# Altium schematic sheet Sheet.SchDoc
size A2; SheetNumber: 1; SheetTotal: 1
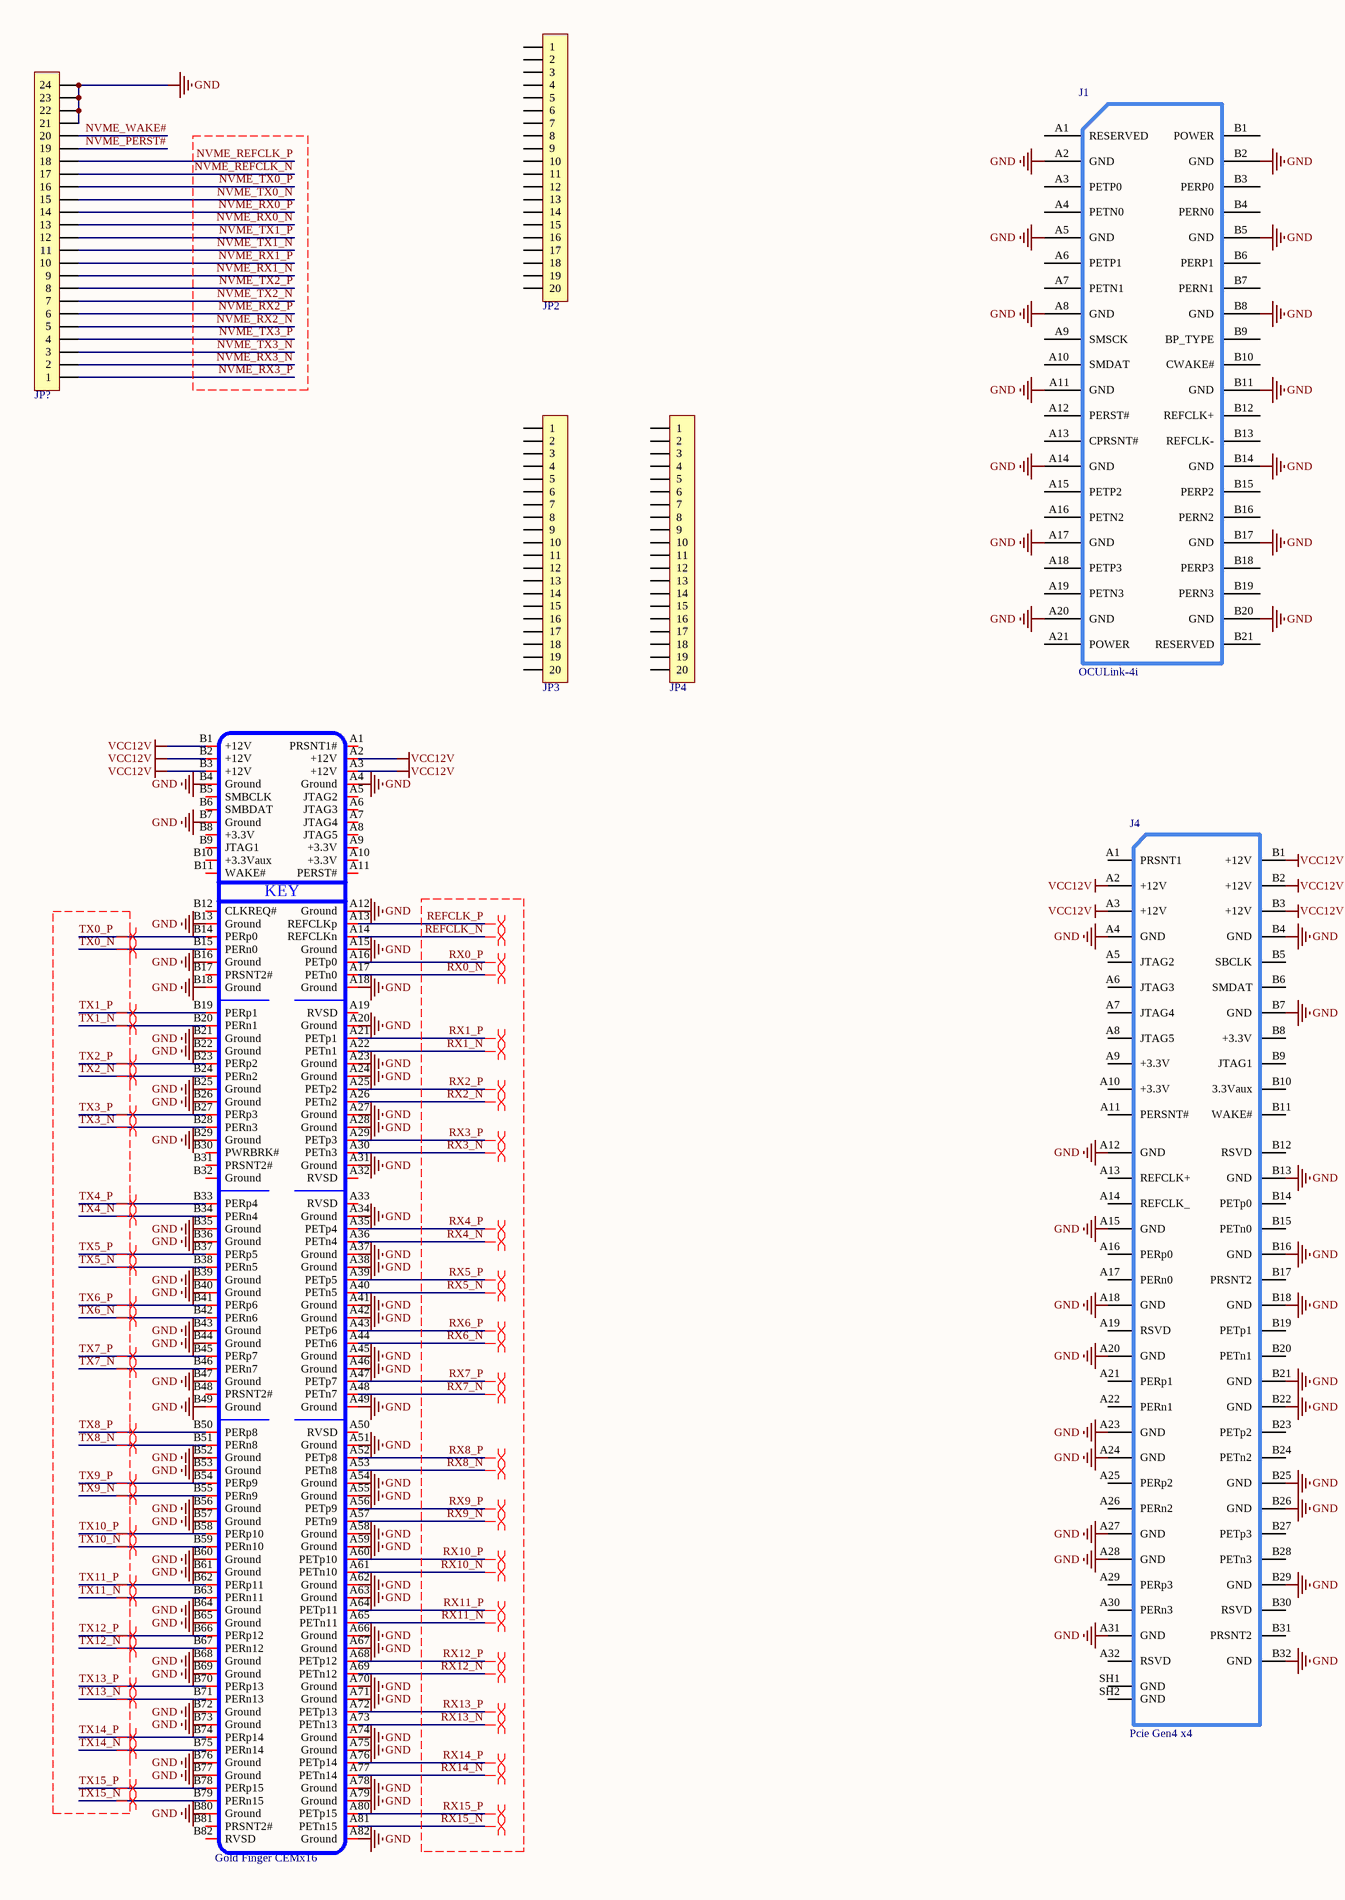
[diagram p0: Sheet.SchDoc, left]
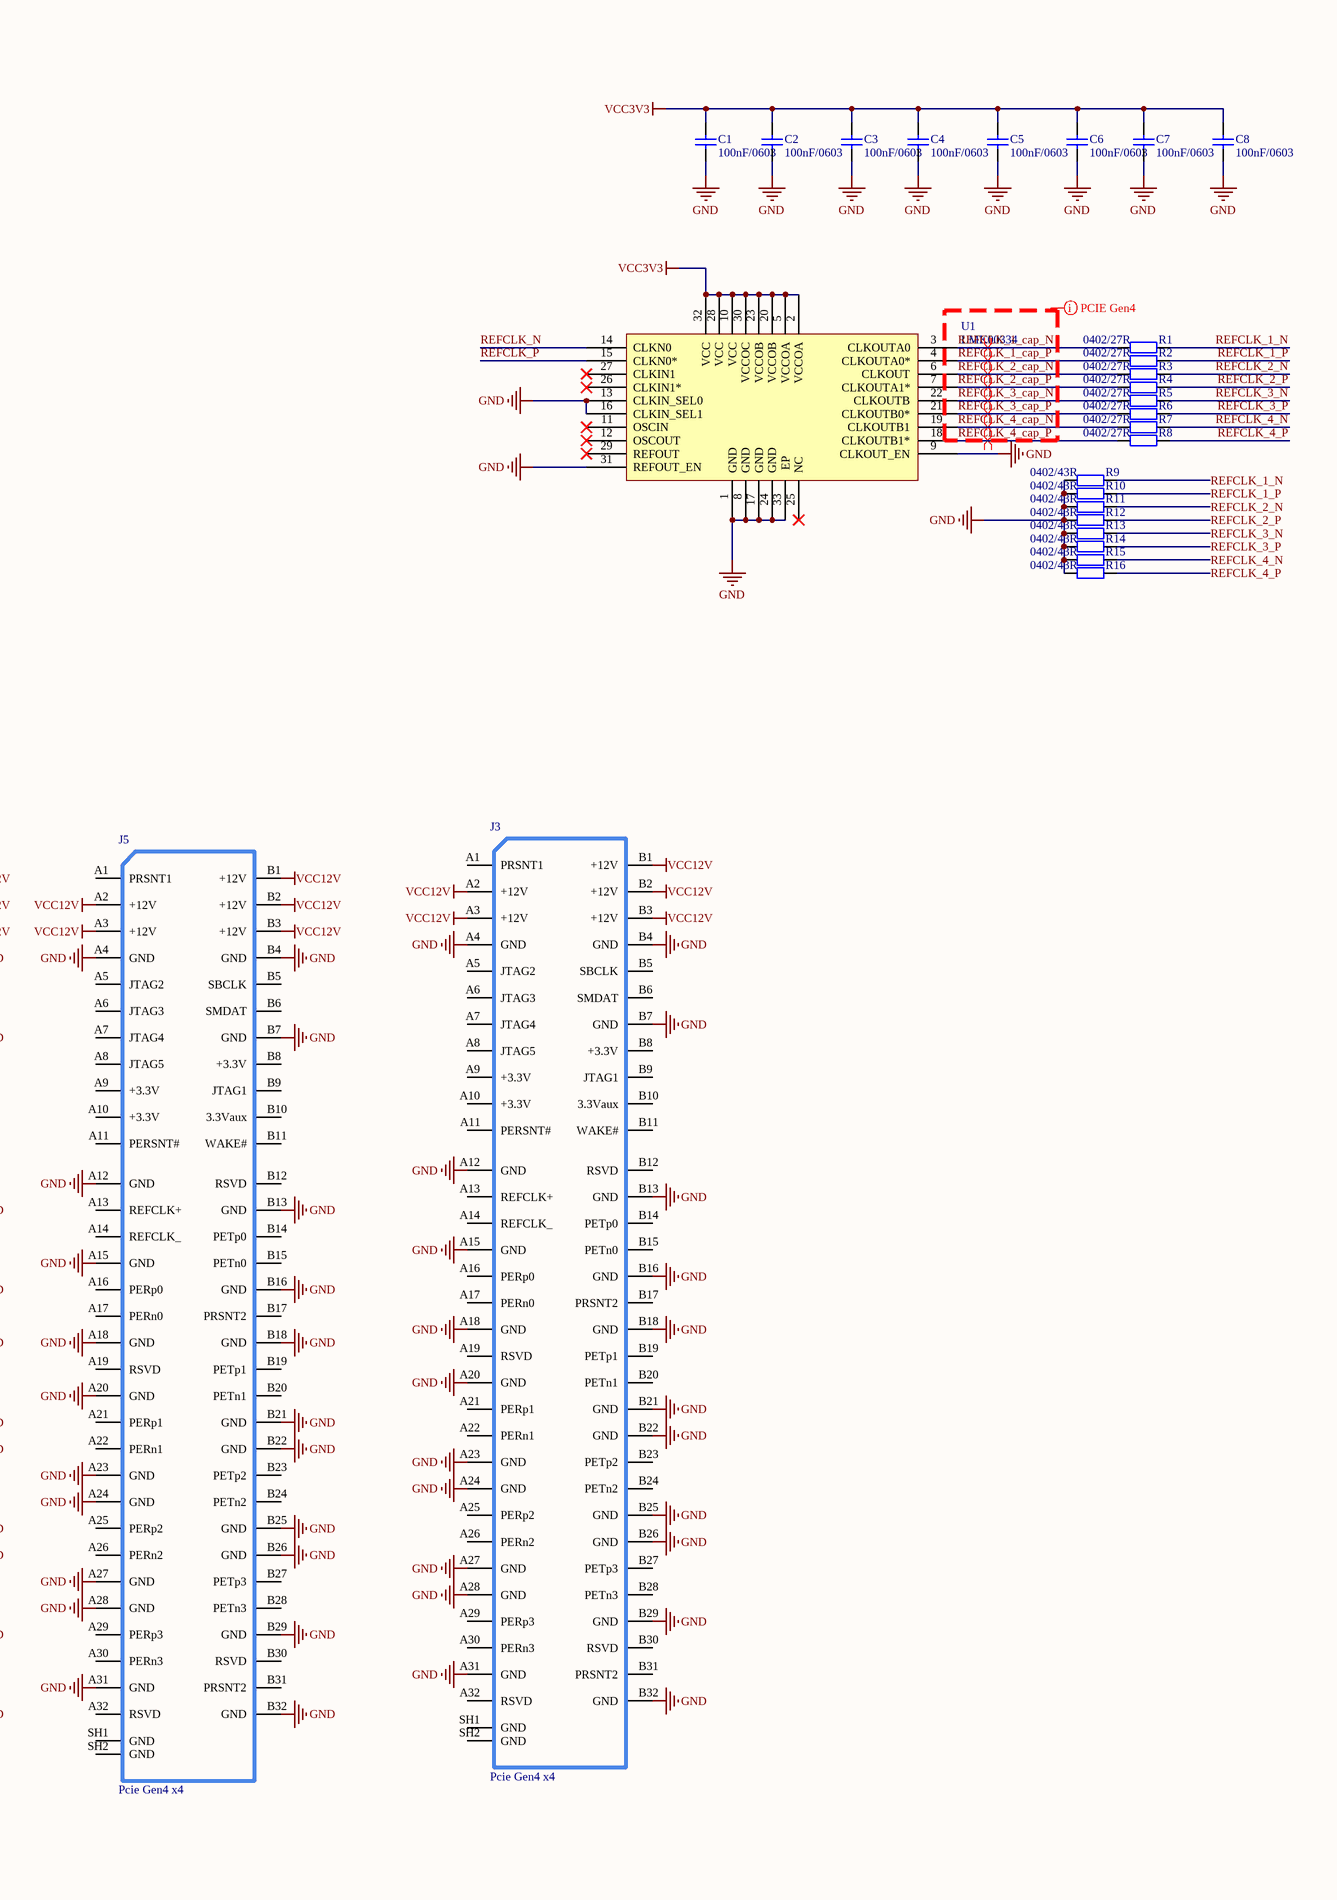
[diagram p1: Sheet.SchDoc, right]

## Parts
C1  100nF/0603  [c0603_l]
C2  100nF/0603  [c0603_l]
C3  100nF/0603  [c0603_l]
C4  100nF/0603  [c0603_l]
C5  100nF/0603  [c0603_l]
C6  100nF/0603  [c0603_l]
C7  100nF/0603  [c0603_l]
C8  100nF/0603  [c0603_l]
J1  OCULink-4i  [SFF8611_卧式]
J2  Device: Gold Finger CEMx16  [CON_PCI-E_164_M]  (hidden comment: Pcie Gen4 x16)
J3  Pcie Gen4 x4  [PCIe Gen4 X4 贴片]
J4  Pcie Gen4 x4  [PCIe Gen4 X4 贴片]
J5  Pcie Gen4 x4  [PCIe Gen4 X4 贴片]
JP2  FPC1.0-20P  [CONN-SMD_20P-P0.50_I-PEX_20455-020E-02]  (value not drawn)
JP3  FPC1.0-20P  [CONN-SMD_20P-P0.50_I-PEX_20455-020E-02]  (value not drawn)
JP4  FPC1.0-20P  [CONN-SMD_20P-P0.50_I-PEX_20455-020E-02]  (value not drawn)
JP?  FPC1.0-24P  [CONN-SMD_20P-P0.50_I-PEX_20455-020E-02]  (value not drawn)
R1  0402/27R  [r0402_l]
R2  0402/27R  [r0402_l]
R3  0402/27R  [r0402_l]
R4  0402/27R  [r0402_l]
R5  0402/27R  [r0402_l]
R6  0402/27R  [r0402_l]
R7  0402/27R  [r0402_l]
R8  0402/27R  [r0402_l]
R9  0402/43R  [r0402_l]
R10  0402/43R  [r0402_l]
R11  0402/43R  [r0402_l]
R12  0402/43R  [r0402_l]
R13  0402/43R  [r0402_l]
R14  0402/43R  [r0402_l]
R15  0402/43R  [r0402_l]
R16  0402/43R  [r0402_l]
U1  LMK00334  [QFN32 5x5_N]

## Nets
GND: C1.1 C2.1 C3.1 C4.1 C5.1 C6.1 C7.1 C8.1 J1.A2(GND) J1.A5(GND) J1.A8(GND) J1.A11(GND) J1.A14(GND) J1.A17(GND) J1.A20(GND) J1.B2(GND) J1.B5(GND) J1.B8(GND) J1.B11(GND) J1.B14(GND) J1.B17(GND) J1.B20(GND) J2.A4(Ground) J2.A12(Ground) J2.A15(Ground) J2.A18(Ground) J2.A20(Ground) J2.A23(Ground) J2.A24(Ground) J2.A27(Ground) J2.A28(Ground) J2.A31(Ground) J2.A34(Ground) J2.A37(Ground) J2.A38(Ground) J2.A41(Ground) J2.A42(Ground) J2.A45(Ground) J2.A46(Ground) J2.A49(Ground) J2.A51(Ground) J2.A54(Ground) J2.A55(Ground) J2.A58(Ground) J2.A59(Ground) J2.A62(Ground) J2.A63(Ground) J2.A66(Ground) J2.A67(Ground) J2.A70(Ground) J2.A71(Ground) J2.A74(Ground) J2.A75(Ground) J2.A78(Ground) J2.A79(Ground) J2.A82(Ground) J2.B4(Ground) J2.B7(Ground) J2.B13(Ground) J2.B16(Ground) J2.B18(Ground) J2.B21(Ground) J2.B22(Ground) J2.B25(Ground) J2.B26(Ground) J2.B29(Ground) J2.B35(Ground) J2.B36(Ground) J2.B39(Ground) J2.B40(Ground) J2.B43(Ground) J2.B44(Ground) J2.B47(Ground) J2.B49(Ground) J2.B52(Ground) J2.B53(Ground) J2.B56(Ground) J2.B57(Ground) J2.B60(Ground) J2.B61(Ground) J2.B64(Ground) J2.B65(Ground) J2.B68(Ground) J2.B69(Ground) J2.B72(Ground) J2.B73(Ground) J2.B76(Ground) J2.B77(Ground) J2.B80(Ground) J3.A4(GND) J3.A12(GND) J3.A15(GND) J3.A18(GND) J3.A20(GND) J3.A23(GND) J3.A24(GND) J3.A27(GND) J3.A28(GND) J3.A31(GND) J3.B4(GND) J3.B7(GND) J3.B13(GND) J3.B16(GND) J3.B18(GND) J3.B21(GND) J3.B22(GND) J3.B25(GND) J3.B26(GND) J3.B29(GND) J3.B32(GND) J4.A4(GND) J4.A12(GND) J4.A15(GND) J4.A18(GND) J4.A20(GND) J4.A23(GND) J4.A24(GND) J4.A27(GND) J4.A28(GND) J4.A31(GND) J4.B4(GND) J4.B7(GND) J4.B13(GND) J4.B16(GND) J4.B18(GND) J4.B21(GND) J4.B22(GND) J4.B25(GND) J4.B26(GND) J4.B29(GND) J4.B32(GND) J5.A4(GND) J5.A12(GND) J5.A15(GND) J5.A18(GND) J5.A20(GND) J5.A23(GND) J5.A24(GND) J5.A27(GND) J5.A28(GND) J5.A31(GND) J5.B4(GND) J5.B7(GND) J5.B13(GND) J5.B16(GND) J5.B18(GND) J5.B21(GND) J5.B22(GND) J5.B25(GND) J5.B26(GND) J5.B29(GND) J5.B32(GND) JP?.21 JP?.22 JP?.23 JP?.24 R9.2 R10.2 R11.2 R12.2 R13.2 R14.2 R15.2 R16.2 U1.1(GND) U1.8(GND) U1.9(CLKOUT_EN) U1.13(CLKIN_SEL0) U1.16(CLKIN_SEL1) U1.17(GND) U1.24(GND) U1.31(REFOUT_EN) U1.33(EP)
VCC3V3: C1.2 C2.2 C3.2 C4.2 C5.2 C6.2 C7.2 C8.2 U1.2(VCCOA) U1.5(VCCOA) U1.10(VCC) U1.20(VCCOB) U1.23(VCCOB) U1.28(VCC) U1.30(VCCOC) U1.32(VCC)
VCC12V: J2.A2(+12V) J2.A3(+12V) J2.B1(+12V) J2.B2(+12V) J2.B3(+12V) J3.A2(+12V) J3.A3(+12V) J3.B1(+12V) J3.B2(+12V) J3.B3(+12V) J4.A2(+12V) J4.A3(+12V) J4.B1(+12V) J4.B2(+12V) J4.B3(+12V) J5.A2(+12V) J5.A3(+12V) J5.B1(+12V) J5.B2(+12V) J5.B3(+12V)
NVME_PERST#: JP?.19
NVME_REFCLK_N: JP?.17
NVME_REFCLK_P: JP?.18
NVME_RX0_N: JP?.13
NVME_RX0_P: JP?.14
NVME_RX1_N: JP?.9
NVME_RX1_P: JP?.10
NVME_RX2_N: JP?.5
NVME_RX2_P: JP?.6
NVME_RX3_N: JP?.2
NVME_RX3_P: JP?.1
NVME_TX0_N: JP?.15
NVME_TX0_P: JP?.16
NVME_TX1_N: JP?.11
NVME_TX1_P: JP?.12
NVME_TX2_N: JP?.7
NVME_TX2_P: JP?.8
NVME_TX3_N: JP?.3
NVME_TX3_P: JP?.4
NVME_WAKE#: JP?.20
REFCLK_1_cap_N: R1.2 U1.3(CLKOUTA0)
REFCLK_1_cap_P: R2.2 U1.4(CLKOUTA0*)
REFCLK_1_N: R1.1 R9.1
REFCLK_1_P: R2.1 R10.1
REFCLK_2_cap_N: R3.2 U1.6(CLKOUT)
REFCLK_2_cap_P: R4.2 U1.7(CLKOUTA1*)
REFCLK_2_N: R3.1 R11.1
REFCLK_2_P: R4.1 R12.1
REFCLK_3_cap_N: R5.2 U1.22(CLKOUTB)
REFCLK_3_cap_P: R6.2 U1.21(CLKOUTB0*)
REFCLK_3_N: R5.1 R13.1
REFCLK_3_P: R6.1 R14.1
REFCLK_4_cap_N: R7.2 U1.19(CLKOUTB1)
REFCLK_4_cap_P: R8.2 U1.18(CLKOUTB1*)
REFCLK_4_N: R7.1 R15.1
REFCLK_4_P: R8.1 R16.1
REFCLK_N: J2.A14(REFCLKn) U1.14(CLKN0)
REFCLK_P: J2.A13(REFCLKp) U1.15(CLKN0*)
RX0_N: J2.A17(PETn0)
RX0_P: J2.A16(PETp0)
RX1_N: J2.A22(PETn1)
RX1_P: J2.A21(PETp1)
RX2_N: J2.A26(PETn2)
RX2_P: J2.A25(PETp2)
RX3_N: J2.A30(PETn3)
RX3_P: J2.A29(PETp3)
RX4_N: J2.A36(PETn4)
RX4_P: J2.A35(PETp4)
RX5_N: J2.A40(PETn5)
RX5_P: J2.A39(PETp5)
RX6_N: J2.A44(PETn6)
RX6_P: J2.A43(PETp6)
RX7_N: J2.A48(PETn7)
RX7_P: J2.A47(PETp7)
RX8_N: J2.A53(PETn8)
RX8_P: J2.A52(PETp8)
RX9_N: J2.A57(PETn9)
RX9_P: J2.A56(PETp9)
RX10_N: J2.A61(PETn10)
RX10_P: J2.A60(PETp10)
RX11_N: J2.A65(PETn11)
RX11_P: J2.A64(PETp11)
RX12_N: J2.A69(PETn12)
RX12_P: J2.A68(PETp12)
RX13_N: J2.A73(PETn13)
RX13_P: J2.A72(PETp13)
RX14_N: J2.A77(PETn14)
RX14_P: J2.A76(PETp14)
RX15_N: J2.A81(PETn15)
RX15_P: J2.A80(PETp15)
TX0_N: J2.B15(PERn0)
TX0_P: J2.B14(PERp0)
TX1_N: J2.B20(PERn1)
TX1_P: J2.B19(PERp1)
TX2_N: J2.B24(PERn2)
TX2_P: J2.B23(PERp2)
TX3_N: J2.B28(PERn3)
TX3_P: J2.B27(PERp3)
TX4_N: J2.B34(PERn4)
TX4_P: J2.B33(PERp4)
TX5_N: J2.B38(PERn5)
TX5_P: J2.B37(PERp5)
TX6_N: J2.B42(PERn6)
TX6_P: J2.B41(PERp6)
TX7_N: J2.B46(PERn7)
TX7_P: J2.B45(PERp7)
TX8_N: J2.B51(PERn8)
TX8_P: J2.B50(PERp8)
TX9_N: J2.B55(PERn9)
TX9_P: J2.B54(PERp9)
TX10_N: J2.B59(PERn10)
TX10_P: J2.B58(PERp10)
TX11_N: J2.B63(PERn11)
TX11_P: J2.B62(PERp11)
TX12_N: J2.B67(PERn12)
TX12_P: J2.B66(PERp12)
TX13_N: J2.B71(PERn13)
TX13_P: J2.B70(PERp13)
TX14_N: J2.B75(PERn14)
TX14_P: J2.B74(PERp14)
TX15_N: J2.B79(PERn15)
TX15_P: J2.B78(PERp15)

Not connected (* = marked no-connect by the designer): J1 A1(RESERVED) A3(PETP0) A4(PETN0) A6(PETP1) A7(PETN1) A9(SMSCK) A10(SMDAT) A12(PERST#) A13(CPRSNT#) A15(PETP2) A16(PETN2) A18(PETP3) A19(PETN3) A21(POWER) B1(POWER) B3(PERP0) B4(PERN0) B6(PERP1) B7(PERN1) B9(BP_TYPE) B10(CWAKE#) B12(REFCLK+) B13(REFCLK-) B15(PERP2) B16(PERN2) B18(PERP3) B19(PERN3) B21(RESERVED); J2 A1(PRSNT1#) A5(JTAG2) A6(JTAG3) A7(JTAG4) A8(JTAG5) A9(+3.3V) A10(+3.3V) A11(PERST#) A19(RVSD) A32(RVSD) A33(RVSD) A50(RVSD) B5(SMBCLK) B6(SMBDAT) B8(+3.3V) B9(JTAG1) B10(+3.3Vaux) B11(WAKE#) B12(CLKREQ#) B17(PRSNT2#) B30(PWRBRK#) B31(PRSNT2#) B32(Ground) B48(PRSNT2#) B81(PRSNT2#) B82(RVSD); J3 A1(PRSNT1) A5(JTAG2) A6(JTAG3) A7(JTAG4) A8(JTAG5) A9(+3.3V) A10(+3.3V) A11(PERSNT#) A13(REFCLK+) A14(REFCLK_) A16(PERp0) A17(PERn0) A19(RSVD) A21(PERp1) A22(PERn1) A25(PERp2) A26(PERn2) A29(PERp3) A30(PERn3) A32(RSVD) B5(SBCLK) B6(SMDAT) B8(+3.3V) B9(JTAG1) B10(3.3Vaux) B11(WAKE#) B12(RSVD) B14(PETp0) B15(PETn0) B17(PRSNT2) B19(PETp1) B20(PETn1) B23(PETp2) B24(PETn2) B27(PETp3) B28(PETn3) B30(RSVD) B31(PRSNT2) SH1(GND) SH2(GND); J4 A1(PRSNT1) A5(JTAG2) A6(JTAG3) A7(JTAG4) A8(JTAG5) A9(+3.3V) A10(+3.3V) A11(PERSNT#) A13(REFCLK+) A14(REFCLK_) A16(PERp0) A17(PERn0) A19(RSVD) A21(PERp1) A22(PERn1) A25(PERp2) A26(PERn2) A29(PERp3) A30(PERn3) A32(RSVD) B5(SBCLK) B6(SMDAT) B8(+3.3V) B9(JTAG1) B10(3.3Vaux) B11(WAKE#) B12(RSVD) B14(PETp0) B15(PETn0) B17(PRSNT2) B19(PETp1) B20(PETn1) B23(PETp2) B24(PETn2) B27(PETp3) B28(PETn3) B30(RSVD) B31(PRSNT2) SH1(GND) SH2(GND); J5 A1(PRSNT1) A5(JTAG2) A6(JTAG3) A7(JTAG4) A8(JTAG5) A9(+3.3V) A10(+3.3V) A11(PERSNT#) A13(REFCLK+) A14(REFCLK_) A16(PERp0) A17(PERn0) A19(RSVD) A21(PERp1) A22(PERn1) A25(PERp2) A26(PERn2) A29(PERp3) A30(PERn3) A32(RSVD) B5(SBCLK) B6(SMDAT) B8(+3.3V) B9(JTAG1) B10(3.3Vaux) B11(WAKE#) B12(RSVD) B14(PETp0) B15(PETn0) B17(PRSNT2) B19(PETp1) B20(PETn1) B23(PETp2) B24(PETn2) B27(PETp3) B28(PETn3) B30(RSVD) B31(PRSNT2) SH1(GND) SH2(GND); JP2 1 2 3 4 5 6 7 8 9 10 11 12 13 14 15 16 17 18 19 20; JP3 1 2 3 4 5 6 7 8 9 10 11 12 13 14 15 16 17 18 19 20; JP4 1 2 3 4 5 6 7 8 9 10 11 12 13 14 15 16 17 18 19 20; U1 11(OSCIN)* 12(OSCOUT)* 25(NC)* 26(CLKIN1*)* 27(CLKIN1)* 29(REFOUT)*

## Layout directives
net class PCIE Gen4: (no net found under the mark)
differential pair: REFCLK_1_cap_N, REFCLK_1_cap_P, REFCLK_2_cap_N, REFCLK_2_cap_P, REFCLK_3_cap_N, REFCLK_3_cap_P, REFCLK_4_cap_N, REFCLK_4_cap_P, REFCLK_N, REFCLK_P, RX0_N, RX0_P, RX1_N, RX1_P, RX2_N, RX2_P, RX3_N, RX3_P, RX4_N, RX4_P, RX5_N, RX5_P, RX6_N, RX6_P, RX7_N, RX7_P, RX8_N, RX8_P, RX9_N, RX9_P, RX10_N, RX10_P, RX11_N, RX11_P, RX12_N, RX12_P, RX13_N, RX13_P, RX14_N, RX14_P, RX15_N, RX15_P, TX0_N, TX0_P, TX1_N, TX1_P, TX2_N, TX2_P, TX3_N, TX3_P, TX4_N, TX4_P, TX5_N, TX5_P, TX6_N, TX6_P, TX7_N, TX7_P, TX8_N, TX8_P, TX9_N, TX9_P, TX10_N, TX10_P, TX11_N, TX11_P, TX12_N, TX12_P, TX13_N, TX13_P, TX14_N, TX14_P, TX15_N, TX15_P

## Notes on the sheet
- (in symbol Pcie Gen4 x16) KEY

## Library data of the parts
C1-C8 = C: 贴片电容/MLCC电容; BOM名称: 无极性贴片电容; 当前库版本V2022.12.25 @淘宝卖家:黄晶宝石: 最新版本发布https://shop463601444.taobao.com
J2 = Pcie Gen4 x16: Add into BOM: no; Convert to PCB: yes; _: 3; Symbol: Gold Finger CEMx16
JP2-JP4 = FPC-20P: FPC连接器; 版权归属: 源创客; BOM名称: FPC连接器; 学习资源: www.ooocke.com
JP? = FPC-24P: FPC连接器; 版权归属: 源创客; BOM名称: FPC连接器; 学习资源: www.ooocke.com
R1-R16 = R: BOM名称: 贴片电阻; 联系下单店铺卖家 免费帮你查找封装: 联系下单店铺卖家 免费技术支持